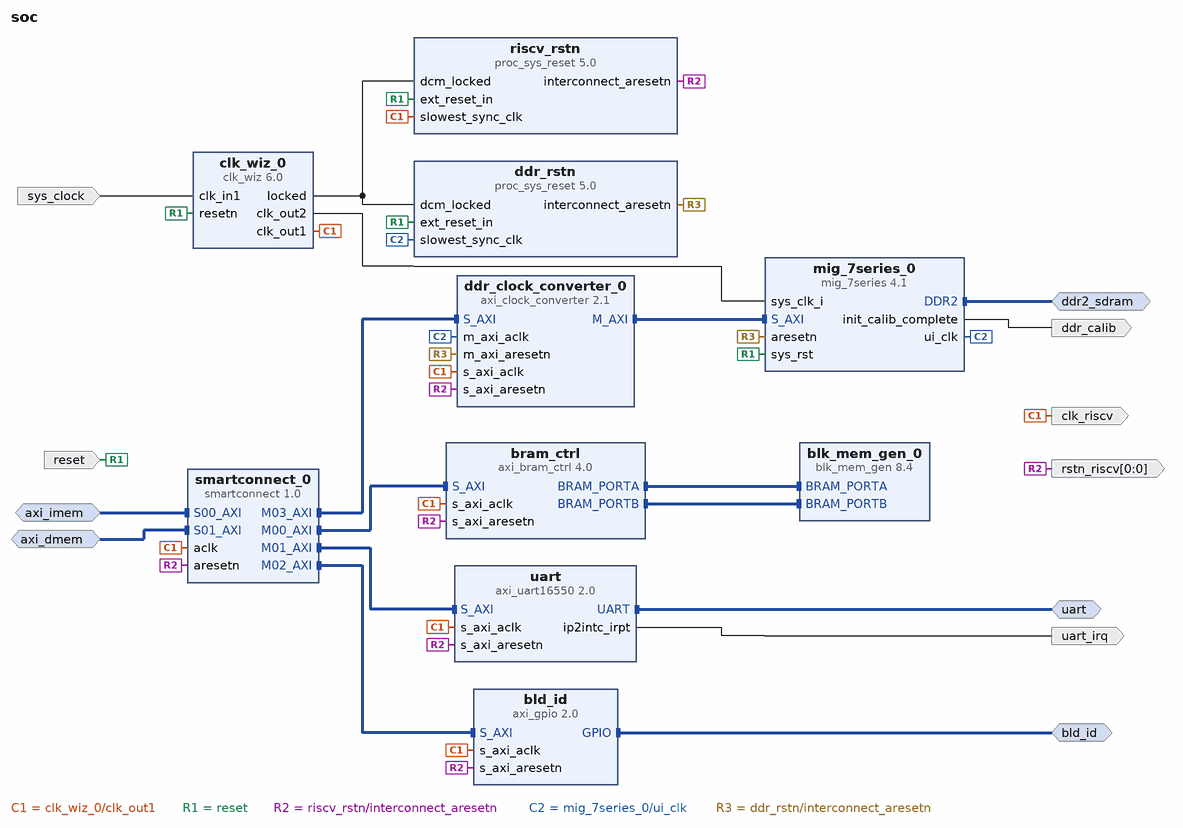
[diagram p0: block diagram of the top level]
# Vivado block design soc, xc7a100tcsg324-1, Vivado 2018.1
create_bd_design soc

create_bd_intf_port -mode Slave -vlnv xilinx.com:interface:aximm_rtl:1.0 axi_imem
set_property -dict [list \
  CONFIG.DATA_WIDTH 32 \
  CONFIG.PROTOCOL AXI4 \
  CONFIG.ID_WIDTH 4 \
  CONFIG.ADDR_WIDTH 32 \
  CONFIG.AWUSER_WIDTH 0 \
  CONFIG.ARUSER_WIDTH 0 \
  CONFIG.WUSER_WIDTH 0 \
  CONFIG.RUSER_WIDTH 0 \
  CONFIG.BUSER_WIDTH 0 \
  CONFIG.READ_WRITE_MODE READ_ONLY \
  CONFIG.HAS_BURST 1 \
  CONFIG.HAS_LOCK 0 \
  CONFIG.HAS_PROT 0 \
  CONFIG.HAS_CACHE 1 \
  CONFIG.HAS_QOS 0 \
  CONFIG.HAS_REGION 0 \
  CONFIG.HAS_WSTRB 1 \
  CONFIG.HAS_BRESP 1 \
  CONFIG.HAS_RRESP 1 \
  CONFIG.SUPPORTS_NARROW_BURST 1 \
  CONFIG.NUM_READ_OUTSTANDING 8 \
  CONFIG.NUM_WRITE_OUTSTANDING 8 \
  CONFIG.MAX_BURST_LENGTH 8 \
  CONFIG.NUM_READ_THREADS 1 \
  CONFIG.NUM_WRITE_THREADS 1 \
  CONFIG.RUSER_BITS_PER_BYTE 0 \
  CONFIG.WUSER_BITS_PER_BYTE 0 \
  CONFIG.master_id 0 \
] [get_bd_intf_ports axi_imem]
create_bd_intf_port -mode Slave -vlnv xilinx.com:interface:aximm_rtl:1.0 axi_dmem
set_property -dict [list \
  CONFIG.DATA_WIDTH 32 \
  CONFIG.PROTOCOL AXI4 \
  CONFIG.ID_WIDTH 4 \
  CONFIG.ADDR_WIDTH 32 \
  CONFIG.AWUSER_WIDTH 0 \
  CONFIG.ARUSER_WIDTH 0 \
  CONFIG.WUSER_WIDTH 0 \
  CONFIG.RUSER_WIDTH 0 \
  CONFIG.BUSER_WIDTH 0 \
  CONFIG.READ_WRITE_MODE READ_WRITE \
  CONFIG.HAS_BURST 1 \
  CONFIG.HAS_LOCK 0 \
  CONFIG.HAS_PROT 0 \
  CONFIG.HAS_CACHE 1 \
  CONFIG.HAS_QOS 0 \
  CONFIG.HAS_REGION 0 \
  CONFIG.HAS_WSTRB 1 \
  CONFIG.HAS_BRESP 1 \
  CONFIG.HAS_RRESP 1 \
  CONFIG.SUPPORTS_NARROW_BURST 1 \
  CONFIG.NUM_READ_OUTSTANDING 0 \
  CONFIG.NUM_WRITE_OUTSTANDING 0 \
  CONFIG.MAX_BURST_LENGTH 8 \
  CONFIG.NUM_READ_THREADS 1 \
  CONFIG.NUM_WRITE_THREADS 1 \
  CONFIG.RUSER_BITS_PER_BYTE 0 \
  CONFIG.WUSER_BITS_PER_BYTE 0 \
  CONFIG.master_id 1 \
] [get_bd_intf_ports axi_dmem]
create_bd_intf_port -mode Master -vlnv xilinx.com:interface:gpio_rtl:1.0 bld_id
create_bd_intf_port -mode Master -vlnv xilinx.com:interface:uart_rtl:1.0 uart
create_bd_intf_port -mode Master -vlnv xilinx.com:interface:ddrx_rtl:1.0 ddr2_sdram
create_bd_port -dir O -type clk clk_riscv
set_property -dict {CONFIG.ASSOCIATED_BUSIF axi_imem:axi_dmem CONFIG.ASSOCIATED_RESET rstn} [get_bd_ports clk_riscv]
create_bd_port -dir O -type intr uart_irq
create_bd_port -dir I -type rst reset
set_property -dict {CONFIG.POLARITY ACTIVE_LOW} [get_bd_ports reset]
create_bd_port -dir O -from 0 -to 0 rstn_riscv
create_bd_port -dir I -type clk sys_clock
set_property -dict {CONFIG.FREQ_HZ 100000000 CONFIG.PHASE 0.000} [get_bd_ports sys_clock]
create_bd_port -dir O ddr_calib

create_bd_cell -type ip -vlnv xilinx.com:ip:axi_bram_ctrl:4.0 bram_ctrl
set_property -dict {CONFIG.SINGLE_PORT_BRAM 0 CONFIG.C_SELECT_XPM 0} [get_bd_cells bram_ctrl]
create_bd_cell -type ip -vlnv xilinx.com:ip:axi_gpio:2.0 bld_id
set_property -dict {CONFIG.C_ALL_INPUTS 1} [get_bd_cells bld_id]
create_bd_cell -type ip -vlnv xilinx.com:ip:axi_uart16550:2.0 uart
set_property -dict [list \
  CONFIG.C_S_AXI_ACLK_FREQ_HZ 30000000 \
  CONFIG.USE_BOARD_FLOW true \
  CONFIG.UART_BOARD_INTERFACE usb_uart \
] [get_bd_cells uart]
create_bd_cell -type ip -vlnv xilinx.com:ip:blk_mem_gen:8.4 blk_mem_gen_0
set_property -dict [list \
  CONFIG.Memory_Type True_Dual_Port_RAM \
  CONFIG.Assume_Synchronous_Clk true \
  CONFIG.Enable_B Use_ENB_Pin \
  CONFIG.Use_RSTB_Pin true \
  CONFIG.Port_B_Clock 100 \
  CONFIG.Port_B_Write_Rate 50 \
  CONFIG.Port_B_Enable_Rate 100 \
  CONFIG.EN_SAFETY_CKT false \
] [get_bd_cells blk_mem_gen_0]
create_bd_cell -type ip -vlnv xilinx.com:ip:smartconnect:1.0 smartconnect_0
set_property -dict {CONFIG.NUM_MI 4 CONFIG.NUM_SI 2 CONFIG.NUM_CLKS 1 CONFIG.HAS_ARESETN 1} [get_bd_cells smartconnect_0]
create_bd_cell -type ip -vlnv xilinx.com:ip:proc_sys_reset:5.0 riscv_rstn
set_property -dict {CONFIG.USE_BOARD_FLOW true CONFIG.RESET_BOARD_INTERFACE reset} [get_bd_cells riscv_rstn]
create_bd_cell -type ip -vlnv xilinx.com:ip:clk_wiz:6.0 clk_wiz_0
set_property -dict [list \
  CONFIG.CLKOUT2_USED true \
  CONFIG.NUM_OUT_CLKS 2 \
  CONFIG.CLKOUT1_REQUESTED_OUT_FREQ 30.000 \
  CONFIG.CLKOUT2_REQUESTED_OUT_FREQ 200.000 \
  CONFIG.USE_LOCKED true \
  CONFIG.USE_RESET true \
  CONFIG.RESET_PORT resetn \
  CONFIG.MMCM_DIVCLK_DIVIDE 1 \
  CONFIG.MMCM_CLKFBOUT_MULT_F 6.000 \
  CONFIG.MMCM_CLKIN1_PERIOD 10.0 \
  CONFIG.MMCM_CLKIN2_PERIOD 10.0 \
  CONFIG.MMCM_CLKOUT0_DIVIDE_F 20.000 \
  CONFIG.MMCM_CLKOUT1_DIVIDE 3 \
  CONFIG.RESET_TYPE ACTIVE_LOW \
  CONFIG.USE_BOARD_FLOW true \
  CONFIG.CLK_IN1_BOARD_INTERFACE sys_clock \
  CONFIG.RESET_BOARD_INTERFACE reset \
  CONFIG.CLKOUT1_JITTER 193.277 \
  CONFIG.CLKOUT1_PHASE_ERROR 132.063 \
  CONFIG.CLKOUT2_JITTER 132.221 \
  CONFIG.CLKOUT2_PHASE_ERROR 132.063 \
] [get_bd_cells clk_wiz_0]
create_bd_cell -type ip -vlnv xilinx.com:ip:axi_clock_converter:2.1 ddr_clock_converter_0
create_bd_cell -type ip -vlnv xilinx.com:ip:proc_sys_reset:5.0 ddr_rstn
set_property -dict {CONFIG.USE_BOARD_FLOW true CONFIG.RESET_BOARD_INTERFACE reset} [get_bd_cells ddr_rstn]
create_bd_cell -type ip -vlnv xilinx.com:ip:mig_7series:4.1 mig_7series_0
set_property -dict {CONFIG.BOARD_MIG_PARAM ddr2_sdram} [get_bd_cells mig_7series_0]

# ---- connections ----

connect_bd_intf_net [get_bd_intf_pins blk_mem_gen_0/BRAM_PORTA] [get_bd_intf_pins bram_ctrl/BRAM_PORTA]
connect_bd_intf_net [get_bd_intf_pins blk_mem_gen_0/BRAM_PORTB] [get_bd_intf_pins bram_ctrl/BRAM_PORTB]
connect_bd_intf_net [get_bd_intf_pins bram_ctrl/S_AXI] [get_bd_intf_pins smartconnect_0/M00_AXI]
connect_bd_intf_net [get_bd_intf_pins smartconnect_0/M02_AXI] [get_bd_intf_pins bld_id/S_AXI]
connect_bd_intf_net [get_bd_intf_pins smartconnect_0/M01_AXI] [get_bd_intf_pins uart/S_AXI]
connect_bd_intf_net [get_bd_intf_pins ddr_clock_converter_0/S_AXI] [get_bd_intf_pins smartconnect_0/M03_AXI]
connect_bd_intf_net [get_bd_intf_pins ddr_clock_converter_0/M_AXI] [get_bd_intf_pins mig_7series_0/S_AXI]
connect_bd_intf_net -intf_net axi [get_bd_intf_ports axi_imem] [get_bd_intf_pins smartconnect_0/S00_AXI]
connect_bd_intf_net -intf_net axi_nc_1 [get_bd_intf_ports axi_dmem] [get_bd_intf_pins smartconnect_0/S01_AXI]
connect_bd_intf_net -intf_net axi_gpio_0_GPIO [get_bd_intf_ports bld_id] [get_bd_intf_pins bld_id/GPIO]
connect_bd_intf_net [get_bd_intf_ports uart] [get_bd_intf_pins uart/UART]
connect_bd_intf_net [get_bd_intf_ports ddr2_sdram] [get_bd_intf_pins mig_7series_0/DDR2]
connect_bd_net -net clk_RISCV [get_bd_pins clk_wiz_0/clk_out1] \
  [get_bd_ports clk_riscv] [get_bd_pins bram_ctrl/s_axi_aclk] [get_bd_pins bld_id/s_axi_aclk] [get_bd_pins uart/s_axi_aclk] \
  [get_bd_pins riscv_rstn/slowest_sync_clk] [get_bd_pins smartconnect_0/aclk] [get_bd_pins ddr_clock_converter_0/s_axi_aclk]
connect_bd_net -net axi_uart16550_0_ip2intc_irpt [get_bd_pins uart/ip2intc_irpt] [get_bd_ports uart_irq]
connect_bd_net [get_bd_ports reset] \
  [get_bd_pins riscv_rstn/ext_reset_in] [get_bd_pins ddr_rstn/ext_reset_in] [get_bd_pins clk_wiz_0/resetn] \
  [get_bd_pins mig_7series_0/sys_rst]
connect_bd_net -net proc_sys_reset_0_interconnect_aresetn [get_bd_pins riscv_rstn/interconnect_aresetn] \
  [get_bd_ports rstn_riscv] [get_bd_pins smartconnect_0/aresetn] [get_bd_pins uart/s_axi_aresetn] \
  [get_bd_pins bld_id/s_axi_aresetn] [get_bd_pins bram_ctrl/s_axi_aresetn] [get_bd_pins ddr_clock_converter_0/s_axi_aresetn]
connect_bd_net [get_bd_ports sys_clock] [get_bd_pins clk_wiz_0/clk_in1]
connect_bd_net -net mig_7series_1_ui_clk [get_bd_pins mig_7series_0/ui_clk] \
  [get_bd_pins ddr_clock_converter_0/m_axi_aclk] [get_bd_pins ddr_rstn/slowest_sync_clk]
connect_bd_net [get_bd_pins ddr_rstn/interconnect_aresetn] [get_bd_pins ddr_clock_converter_0/m_axi_aresetn] [get_bd_pins mig_7series_0/aresetn]
connect_bd_net [get_bd_pins mig_7series_0/init_calib_complete] [get_bd_ports ddr_calib]
connect_bd_net [get_bd_pins clk_wiz_0/locked] [get_bd_pins ddr_rstn/dcm_locked] [get_bd_pins riscv_rstn/dcm_locked]
connect_bd_net [get_bd_pins clk_wiz_0/clk_out2] [get_bd_pins mig_7series_0/sys_clk_i]

# ---- address map ----
assign_bd_address -offset 0x00000000 -range 128M -target_address_space [get_bd_addr_spaces axi_dmem] [get_bd_addr_segs mig_7series_0/memmap/memaddr]
assign_bd_address -offset 0xFF000000 -range 4K -target_address_space [get_bd_addr_spaces axi_dmem] [get_bd_addr_segs bld_id/S_AXI/Reg]
assign_bd_address -offset 0xFF010000 -range 4K -target_address_space [get_bd_addr_spaces axi_dmem] [get_bd_addr_segs uart/S_AXI/Reg]
assign_bd_address -offset 0xFFFF0000 -range 64K -target_address_space [get_bd_addr_spaces axi_dmem] [get_bd_addr_segs bram_ctrl/S_AXI/Mem0]
assign_bd_address -offset 0x00000000 -range 128M -target_address_space [get_bd_addr_spaces axi_imem] [get_bd_addr_segs mig_7series_0/memmap/memaddr]
assign_bd_address -offset 0xFFFF0000 -range 64K -target_address_space [get_bd_addr_spaces axi_imem] [get_bd_addr_segs bram_ctrl/S_AXI/Mem0]
exclude_bd_addr_seg -offset 0xFF000000 -range 4K -target_address_space [get_bd_addr_spaces axi_imem] [get_bd_addr_segs bld_id/S_AXI/Reg]
exclude_bd_addr_seg -offset 0xFF010000 -range 4K -target_address_space [get_bd_addr_spaces axi_imem] [get_bd_addr_segs uart/S_AXI/Reg]

validate_bd_design
save_bd_design
